# Altium schematic sheet 3_AASTM32-Peripheral.SchDoc
size A4; SheetNumber: 4; SheetTotal: 4
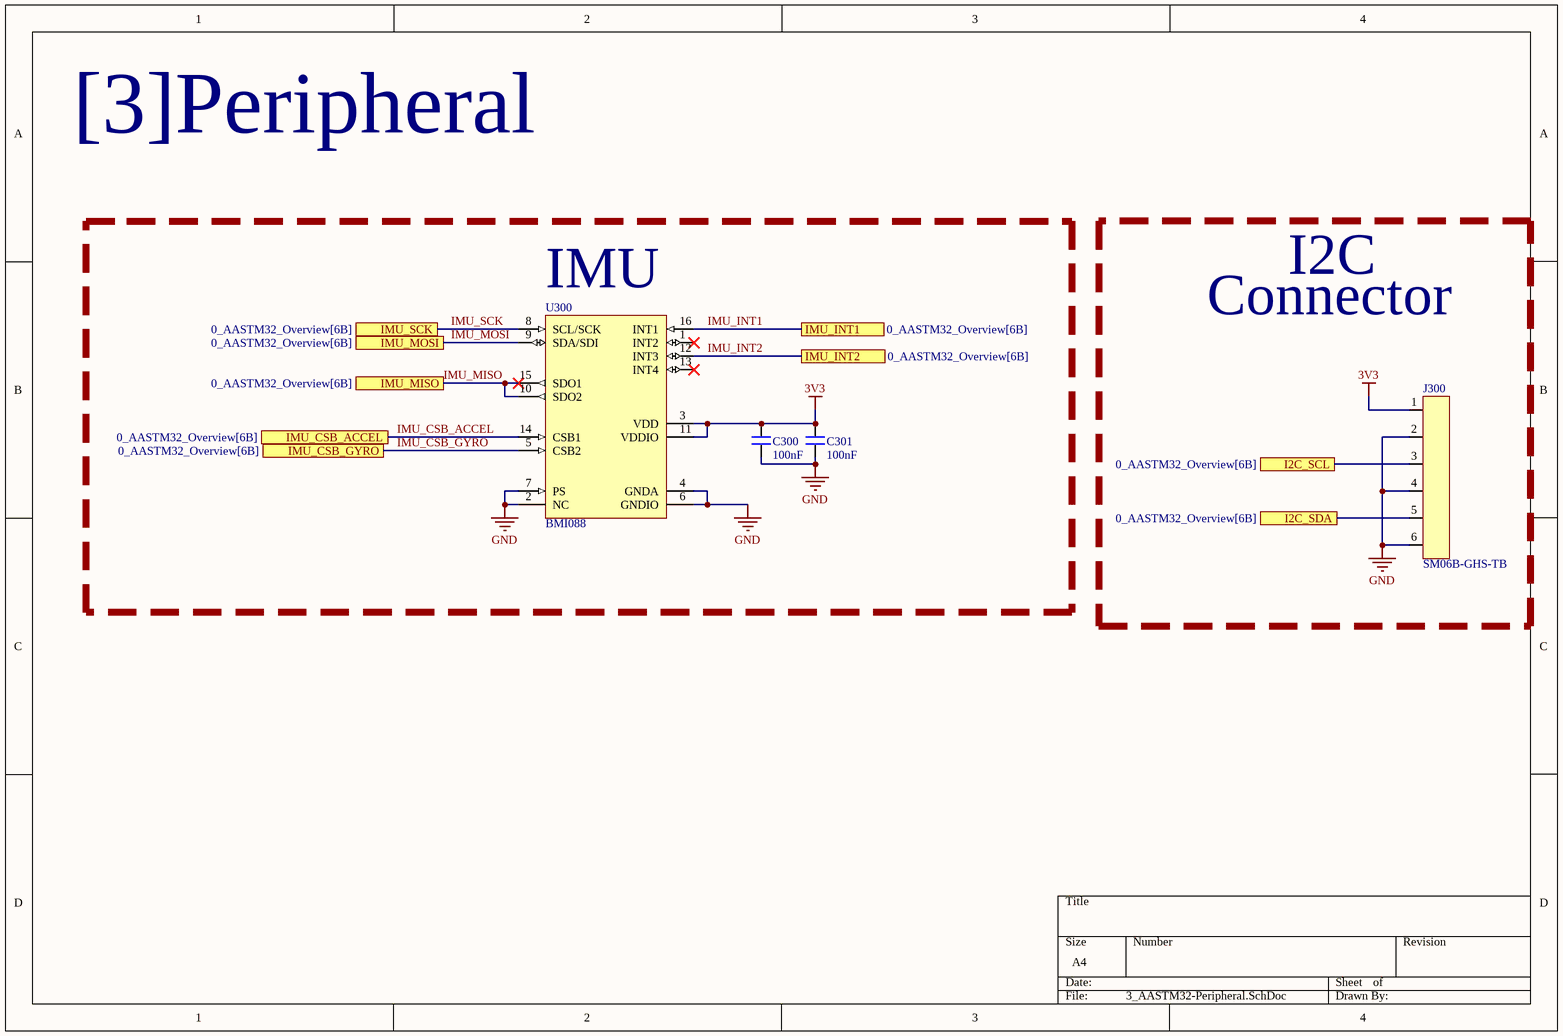
[diagram p0: 3_AASTM32-Peripheral.SchDoc]

## Parts
C300  100nF  [0603 CAP]
C301  100nF  [0603 CAP]
J300  SM06B-GHS-TB  [SM06B-GHS-TB]
U300  BMI088  [LGA-16 BOSCH]

## Blocks framed on the sheet
IMU: C300 C301 U300

## Ports
I2C_SCL (see 0_AASTM32_Overview[6B]), I2C_SDA (see 0_AASTM32_Overview[6B]), IMU_CSB_ACCEL (see 0_AASTM32_Overview[6B]), IMU_CSB_GYRO (see 0_AASTM32_Overview[6B]), IMU_INT1 (see 0_AASTM32_Overview[6B]), IMU_INT2 (see 0_AASTM32_Overview[6B]), IMU_MISO (see 0_AASTM32_Overview[6B]), IMU_MOSI (see 0_AASTM32_Overview[6B]), IMU_SCK (see 0_AASTM32_Overview[6B])

## Nets
3V3: C300.2 C301.2 J300.1 U300.3(VDD) U300.11(VDDIO)
GND: C300.1 C301.1 J300.2 J300.4 J300.6 U300.2(NC) U300.4(GNDA) U300.6(GNDIO) U300.7(PS)
I2C_SCL: J300.3 ; port I2C_SCL
I2C_SDA: J300.5 ; port I2C_SDA
IMU_CSB_ACCEL: U300.14(CSB1) ; port IMU_CSB_ACCEL
IMU_CSB_GYRO: U300.5(CSB2) ; port IMU_CSB_GYRO
IMU_INT1: U300.16(INT1) ; port IMU_INT1
IMU_INT2: U300.12(INT3) ; port IMU_INT2
IMU_MISO: U300.10(SDO2) U300.15(SDO1) ; port IMU_MISO
IMU_MOSI: U300.9(SDA/SDI) ; port IMU_MOSI
IMU_SCK: U300.8(SCL/SCK) ; port IMU_SCK

Not connected (* = marked no-connect by the designer): U300 1(INT2)* 13(INT4)*

## Notes on the sheet
- [3]Peripheral
- I2C
- Connector

## Library data of the parts
C300 C301 = 0603 4u7 CAP: Ceramic Capacitor, Multilayer, Ceramic, 25V, 10% +Tol, 10% -Tol, X5R, 15% TC, 4.7uF, Surface Mount, 0603; Manufacturer: Samsung; Manufacturer Part Number: CL10A475KA8NQNC; Multilayer: Yes; Case: 0603; Supplier: Digikey; Supplier Part Number: 1276-1900-1-ND; RoHS: Yes; Category: Ceramic Capacitors; Stock: 1806164; Pricing: 1=0,35, 10=0,226, 50=0,1584, 100=0,1279, 500=0,09502, 1000=0,08314 (USD); Mounting Technology: Surface Mount; Pins: 2; Package Shape: Rectangular; Terminal Finish: Nickel; Dielectric Material: Ceramic; Case/Package: 0603; Min Operating Temperature: -55°C; Max Operating Temperature: 85°C; JESD-609 Code: e3; Package Style: SMTMeter; Value: 4.7uF; Capacitor Type: Ceramic; Tolerance  (fill in as +-): 10%; Packaging: Tape and Reel; Tolerance (fill in as +-): 10%; Rated DC Voltage (URdc): 25V; Temperature Characteristics Code: X5R; Termination: Wraparound; Length: 1.6mm; Width: 0.8mm; Height: 0.95mm; Reach SVHC Compliant: Yes; RoHS Compliant: Yes; ComponentLink1URL: https://datasheet.ciiva.com:443/pdfs/VipMasterIC/IC/SEMS/SEMS-S-A0008384515/SEMS-S-A0008873295-1.pdf?src-supplier=IHS+Markit; ComponentLink1Description: https://datasheet.ciiva.com:443/pdfs/VipMasterIC/IC/SEMS/SEMS-S-A0008384515/SEMS-S-A0008873295-1.pdf?src-supplier=IHS+Markit; ComponentLink2URL: https://datasheet.ciiva.com/25787/cl10a475ka8nqnc-25787017.pdf?src-supplier=Digikey; ComponentLink2Description: https://datasheet.ciiva.com/25787/cl10a475ka8nqnc-25787017.pdf?src-supplier=Digikey
J300 = SM06B-GHS-TB: Header Connector 6 Position 1.25MM Pitch SMD Horizontal JST GH; Manufacturer: JST; Manufacturer Part Number: SM06B-GHS-TB
U300 = BMI088: IMUs - Inertial Measurement Units High Performance Intertial Measurement Unit (IMU) for Drones and Robotics; Manufacturer: Bosch Sensortec; Manufacturer Part Number: BMI088